# Altium schematic sheet esp8266.SchDoc
size A4
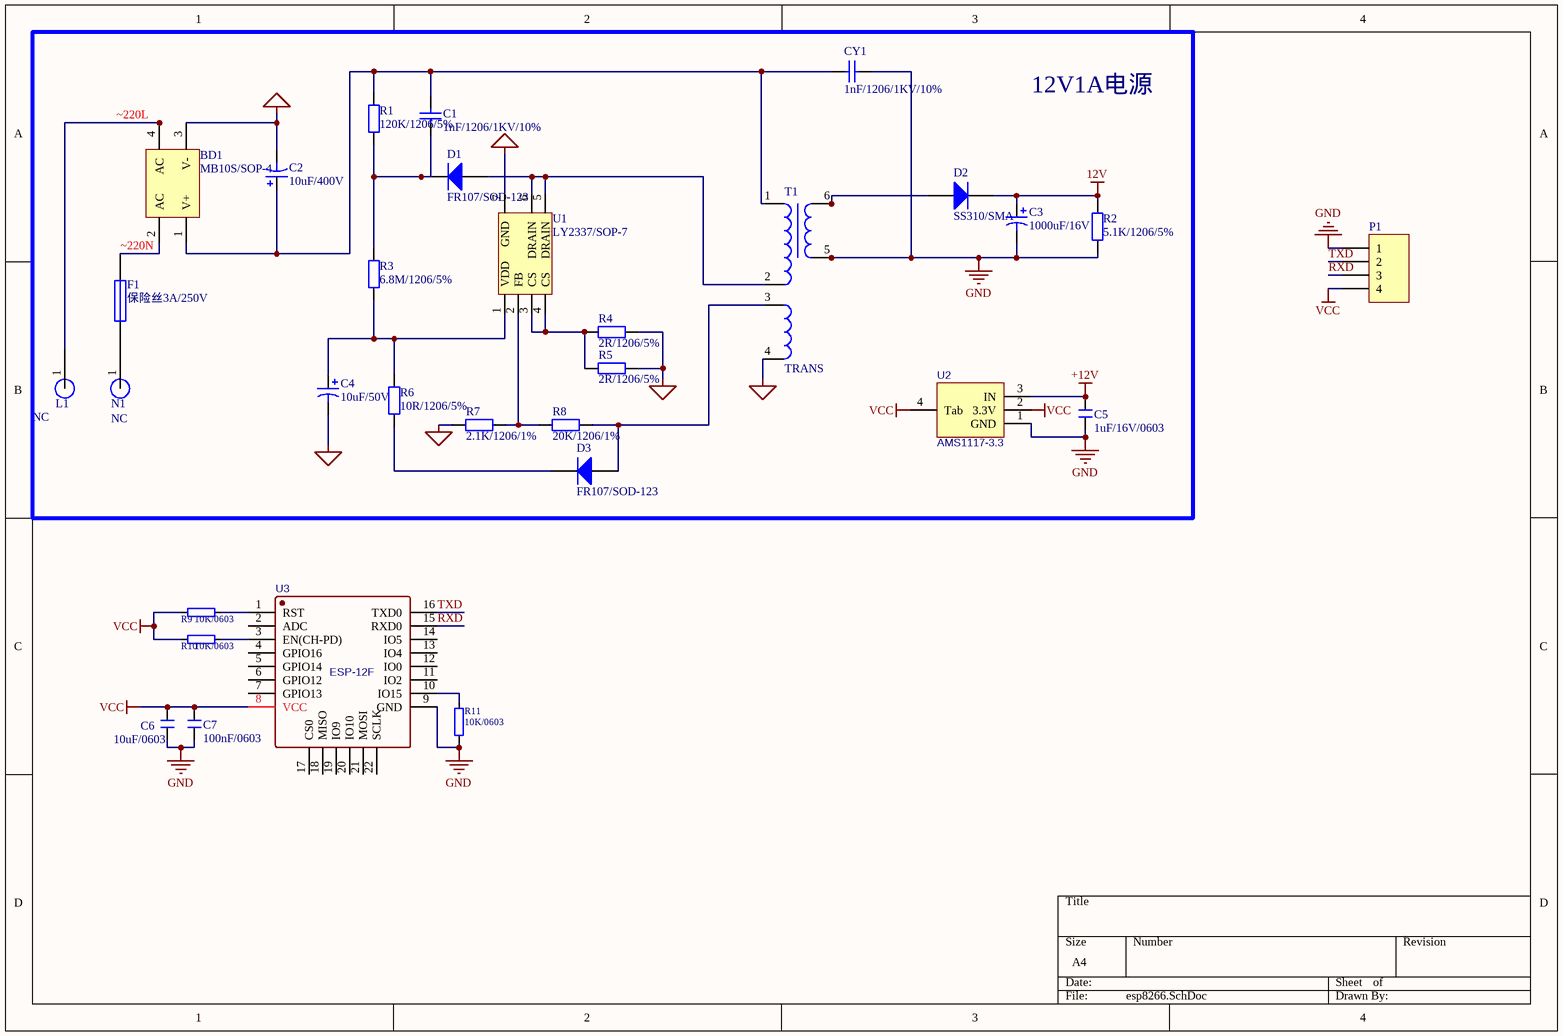
[diagram p0: esp8266.SchDoc]

## Parts
BD1  MB10S/SOP-4  [MBL10S]
C1  1nF/1206/1KV/10%  [C1206]
C2  10uF/400V  [400V/10uF 8*12mm]
C3  1000uF/16V  [16V/1000uF 8*16mm -2]
C4  10uF/50V  [50V/10uF]
C5  1uF/16V/0603  [C0603]
C6  10uF/0603  [C0603]
C7  100nF/0603  [C0603]
CY1  1nF/1206/1KV/10%  [C1206]
D1  FR107/SOD-123  [SOD123]
D2  SS310/SMA  [SMA]
D3  FR107/SOD-123  [SOD123]
F1  保险丝3A/250V  [方块保险丝4*8mm]
L1  NC  [PAD]
N1  NC  [PAD]
P1  Header 4  [HDR1X4]  (value not drawn)
R1  120K/1206/5%  [R1206]
R2  5.1K/1206/5%  [R1206]
R3  6.8M/1206/5%  [R1206]
R4  2R/1206/5%  [R1206]
R5  2R/1206/5%  [R1206]
R6  10R/1206/5%  [R1206]
R7  2.1K/1206/1%  [R1206]
R8  20K/1206/1%  [R1206]
R9  10K/0603  [R0603]
R10  10K/0603  [R0603]
R11  10K/0603  [R0603]
T1  TRANS  [EPC-17_2]
U1  LY2337/SOP-7  [SOP-7]
U2  AMS1117-3.3  [SOT-223_L6.5-W3.5-P2.30-LS7.0-BR]
U3  ESP-12F  [WIFIM-SMD_ESP-12F-ESP8266MOD]

## Blocks framed on the sheet
12V1A电源: BD1 C1-C5 CY1 D1-D3 F1 L1 N1 R1-R8 T1 U1 U2

## Nets
12V: C3.1 D2.2(K) R2.2
+12V: C5.2 U2.3(IN)
AGND: BD1.3(V-) C2.2 C4.2 R4.2 R5.2 R7.1 T1.4 U1.7(GND)
GND: C3.2 C5.1 C6.1 C7.1 CY1.2 P1.1 R2.1 R11.1 T1.5 U2.1(GND) U3.9(GND)
VCC: C6.2 C7.2 P1.4 R9.1 R10.1 U2.2(3.3V) U2.4(Tab) U3.8(VCC)
RXD: P1.3 U3.15(RXD0)
TXD: P1.2 U3.16(TXD0)
~220L: BD1.4(AC) L1.1
~220N: BD1.2(AC) F1.2
NetBD1_1: BD1.1(V+) C1.2 C2.1 CY1.1 R1.2 T1.1
NetC1_1: C1.1 D1.2(K) R1.1 R3.2
NetC4_1: C4.1 R3.1 R6.1 U1.1(VDD)
NetD1_1: D1.1(A) T1.2 U1.5(DRAIN) U1.6(DRAIN)
NetD2_1: D2.1(A) T1.6
NetD3_1: D3.1(A) R8.2 T1.3
NetD3_2: D3.2(K) R6.2
NetF1_1: F1.1 N1.1
NetR4_1: R4.1 R5.1 U1.3(CS) U1.4(CS)
NetR7_2: R7.2 R8.1 U1.2(FB)
NetR9_2: R9.2 U3.1(RST)
NetR10_2: R10.2 U3.3(EN(CH-PD))
NetR11_2: R11.2 U3.10(IO15)

Not connected (* = marked no-connect by the designer): U3 2(ADC) 4(GPIO16) 5(GPIO14) 6(GPIO12) 7(GPIO13) 11(IO2) 12(IO0) 13(IO4) 14(IO5) 17(CS0) 18(MISO) 19(IO9) 20(IO10) 21(MOSI) 22(SCLK)

## Library data of the parts
BD1 = Bridge2: 整流桥 MB10S/SOP-4; Published: 24-Mar-1999; LatestRevisionDate: 17-Jul-2002; LatestRevisionNote: Re-released for DXP Platform.; PackageReference: D-46_6A; Publisher: Altium Limited; PackageDescription: Bridge Rectifier; 4 Terminals; Body 16.8 x 16.8 mm (typ); Pitch 10.67 mm
C1 CY1 = Cap: 1nF/1206/50V/10%; Published: 8-Jun-2000; LatestRevisionDate: 17-Jul-2002; LatestRevisionNote: Re-released for DXP Platform.; PackageReference: RAD-0.3; Publisher: Altium Limited; PackageDescription: Radial Cap, Thru-Hole; 2 Leads; 0.3 in Pin Spacing; Value: ?
C2 = Cap Pol1: 直插电解电容10uF/400V; Published: 8-Jun-2000; LatestRevisionDate: 17-Jul-2002; LatestRevisionNote: Re-released for DXP Platform.; PackageReference: RB7.6-15; Publisher: Altium Limited; PackageDescription: Polarized Capacitor (Radial); 2 Leads; Value: ?
C3 = Cap Pol1: 直插电解电容1000uF/16V; Published: 8-Jun-2000; LatestRevisionDate: 17-Jul-2002; LatestRevisionNote: Re-released for DXP Platform.; PackageReference: RB7.6-15; Publisher: Altium Limited; PackageDescription: Polarized Capacitor (Radial); 2 Leads; Value: ?
C4 = Cap Pol1: 直插电解电容10uF/50V; Published: 8-Jun-2000; LatestRevisionDate: 17-Jul-2002; LatestRevisionNote: Re-released for DXP Platform.; PackageReference: RB7.6-15; Publisher: Altium Limited; PackageDescription: Polarized Capacitor (Radial); 2 Leads; Value: ?
C5-C7 = CAP
D1 D3 = Diode: 快恢复二极管 FR107 封装SOD-123; Published: 8-Jun-2000; LatestRevisionDate: 17-Jul-2002; LatestRevisionNote: Re-released for DXP Platform.; PackageVersion: Sep-1996; PackageReference: SMC; Publisher: Altium Limited; PackageDescription: DO-214-AB/SMC; 2 C-Bend Leads; Body 7.9 x 5.9 mm, inc. leads (LxW); Code_JEDEC: DO-214-AB
D2 = Diode: 肖特基二极管 SS310/封装 SMA; Published: 8-Jun-2000; LatestRevisionDate: 17-Jul-2002; LatestRevisionNote: Re-released for DXP Platform.; PackageVersion: Sep-1996; PackageReference: SMC; Publisher: Altium Limited; PackageDescription: DO-214-AB/SMC; 2 C-Bend Leads; Body 7.9 x 5.9 mm, inc. leads (LxW); Code_JEDEC: DO-214-AB
F1 = Fuse 1: Published: 8-Jun-2000; LatestRevisionDate: 17-Jul-2002; LatestRevisionNote: Re-released for DXP Platform.; PackageReference: PIN-W2/E2.8; Publisher: Altium Limited; PackageDescription: Thru-Hole; 2 Leads
L1 N1 = Welding-hole: 焊接点
P1 = Header 4: Header, 4-Pin; LatestRevisionDate: 17-Jul-2002; LatestRevisionNote: Re-released for DXP Platform.; Publisher: Altium Limited
R1 = Res2: Resistor 120K/1206/5%; Value: 1K; Published: 8-Jun-2000; LatestRevisionDate: 17-Jul-2002; LatestRevisionNote: Re-released for DXP Platform.; PackageReference: AXIAL-0.4; Publisher: Altium Limited; PackageDescription: Axial Device, Thru-Hole; 2 Leads; 0.4 in Pin Spacing
R2 = Res2: Resistor 5.1K/1206/5%; Value: 1K; Published: 8-Jun-2000; LatestRevisionDate: 17-Jul-2002; LatestRevisionNote: Re-released for DXP Platform.; PackageReference: AXIAL-0.4; Publisher: Altium Limited; PackageDescription: Axial Device, Thru-Hole; 2 Leads; 0.4 in Pin Spacing
R3 = Res2: Resistor 6.8M/1206/5%  6.8兆欧姆; Value: 1K; Published: 8-Jun-2000; LatestRevisionDate: 17-Jul-2002; LatestRevisionNote: Re-released for DXP Platform.; PackageReference: AXIAL-0.4; Publisher: Altium Limited; PackageDescription: Axial Device, Thru-Hole; 2 Leads; 0.4 in Pin Spacing
R4 R5 = Res2: Resistor 2R/1206/5%; Value: 1K; Published: 8-Jun-2000; LatestRevisionDate: 17-Jul-2002; LatestRevisionNote: Re-released for DXP Platform.; PackageReference: AXIAL-0.4; Publisher: Altium Limited; PackageDescription: Axial Device, Thru-Hole; 2 Leads; 0.4 in Pin Spacing
R6 = Res2: Resistor 10R/1206/5%; Value: 1K; Published: 8-Jun-2000; LatestRevisionDate: 17-Jul-2002; LatestRevisionNote: Re-released for DXP Platform.; PackageReference: AXIAL-0.4; Publisher: Altium Limited; PackageDescription: Axial Device, Thru-Hole; 2 Leads; 0.4 in Pin Spacing
R7 = Res2: Resistor 2.1K/1206/1%; Value: 1K; Published: 8-Jun-2000; LatestRevisionDate: 17-Jul-2002; LatestRevisionNote: Re-released for DXP Platform.; PackageReference: AXIAL-0.4; Publisher: Altium Limited; PackageDescription: Axial Device, Thru-Hole; 2 Leads; 0.4 in Pin Spacing
R8 = Res2: Resistor 20K/1206/1%; Value: 1K; Published: 8-Jun-2000; LatestRevisionDate: 17-Jul-2002; LatestRevisionNote: Re-released for DXP Platform.; PackageReference: AXIAL-0.4; Publisher: Altium Limited; PackageDescription: Axial Device, Thru-Hole; 2 Leads; 0.4 in Pin Spacing
R9-R11 = RES
T1 = TRANS: 变压器
U1 = Component_1
U2 = AMS1117-3.3: BOM_Manufacturer: SK; Contributor: LCSC; SMT Type: Extend; BOM_Supplier: LCSC; BOM_Supplier Part: C165482; BOM_Manufacturer Part: AMS1117-3.3; BOM_LCSC Assembly: Yes; spicePre: U; spiceSymbolName: AMS1117-3.3_C165482
U3 = ESP-12F(ESP8266MOD): BOM_Manufacturer: Ai-Thinker; BOM_Supplier: LCSC; BOM_Manufacturer Part: ESP-12F(ESP8266MOD); BOM_Supplier Part: C82891; spicePre: U; spiceSymbolName: ESP-12F(ESP8266MOD)